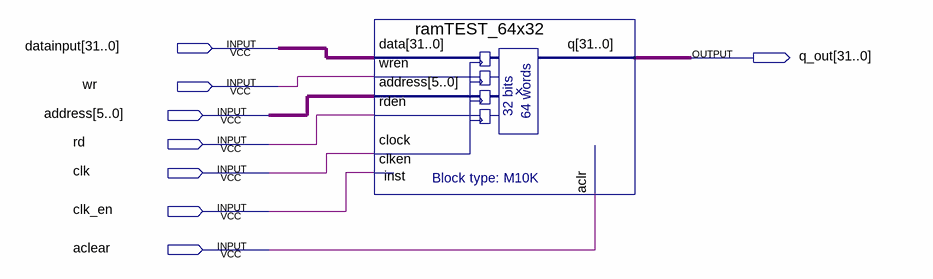
[diagram p0: schematic sheet]
// Quartus schematic ramTest.bdf as structural Verilog: 1 symbols, 8 pins
module ramTest (
  input  [31:0] datainput,
  input  wr,
  input  [5:0] address,
  input  rd,
  input  clk,
  input  clk_en,
  input  aclear,
  output [31:0] q_out
);

  ramTEST_64x32 inst (
    .data(datainput), .wren(wr), .address(address), .rden(rd), .clock(clk), .clken(clk_en), .aclr(aclear),
    .q(q_out));
endmodule
